# Altium schematic sheet Motordrivare.SchDoc
size A4
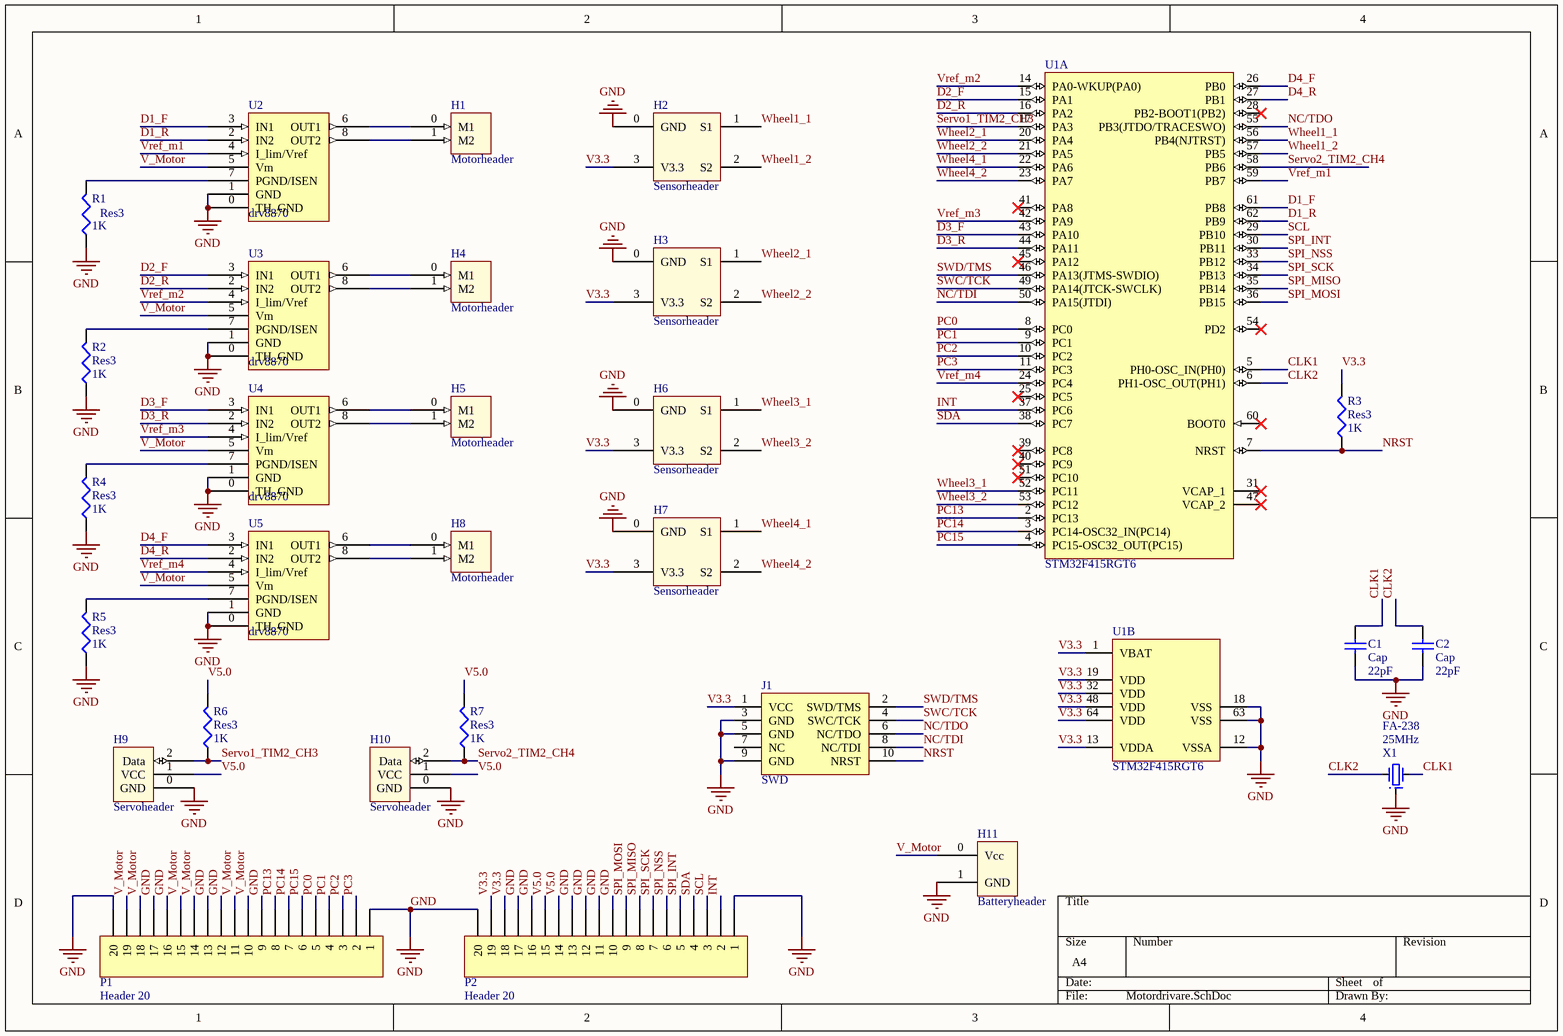
[diagram p0: Motordrivare.SchDoc]

## Parts
C1  Cap  value 22pF  [6-0805_M]
C2  Cap  value 22pF  [6-0805_M]
H1  Motorheader  [Motorheader]
H2  Sensorheader  [Sensorheader]
H3  Sensorheader  [Sensorheader]
H4  Motorheader  [Motorheader]
H5  Motorheader  [Motorheader]
H6  Sensorheader  [Sensorheader]
H7  Sensorheader  [Sensorheader]
H8  Motorheader  [Motorheader]
H9  Servoheader  [Servoheader]
H10  Servoheader  [Servoheader]
H11  Batteryheader  [Batteryheader]
J1  SWD  [hdr_2x5_50mil]
P1  Header 20  [HDR1X20]
P2  Header 20  [HDR1X20]
R1  Res3  value 1K  [J1-0603]
R2  Res3  value 1K  [J1-0603]
R3  Res3  value 1K  [J1-0603]
R4  Res3  value 1K  [J1-0603]
R5  Res3  value 1K  [J1-0603]
R6  Res3  value 1K  [J1-0603]
R7  Res3  value 1K  [J1-0603]
U1  STM32F415RGT6  [STM-LQFP64_N]  (parts A,B of 2)
U2  drv8870  [DRV8p]
U3  drv8870  [DRV8p]
U4  drv8870  [DRV8p]
U5  drv8870  [DRV8p]
X1  FA-238  freq: 25MHz  [DFN220P320X70-4N]

## Nets
GND: C1.1 C2.1 H2.0(GND) H3.0(GND) H6.0(GND) H7.0(GND) H9.0(GND) H10.0(GND) H11.1(GND) J1.3(GND) J1.5(GND) J1.9(GND) P1.1 P1.9 P1.12 P1.13 P1.16 P1.17 P1.20 P2.1 P2.10 P2.11 P2.12 P2.13 P2.16 P2.17 P2.20 R1.1 R2.1 R4.1 R5.1 U1.12(VSSA) U1.18(VSS) U1.63(VSS) U2.0(TH_GND) U2.1(GND) U3.0(TH_GND) U3.1(GND) U4.0(TH_GND) U4.1(GND) U5.0(TH_GND) U5.1(GND) X1.SHIELD
CLK1: C1.2 U1.5(PH0-OSC_IN(PH0)) X1.2
CLK2: C2.2 U1.6(PH1-OSC_OUT(PH1)) X1.1
D1_F: U1.61(PB8) U2.3(IN1)
D1_R: U1.62(PB9) U2.2(IN2)
D2_F: U1.15(PA1) U3.3(IN1)
D2_R: U1.16(PA2) U3.2(IN2)
D3_F: U1.43(PA10) U4.3(IN1)
D3_R: U1.44(PA11) U4.2(IN2)
D4_F: U1.26(PB0) U5.3(IN1)
D4_R: U1.27(PB1) U5.2(IN2)
INT: P2.2 U1.37(PC6)
NC/TDI: J1.8(NC/TDI) U1.50(PA15(JTDI))
NC/TDO: J1.6(NC/TDO) U1.55(PB3(JTDO/TRACESWO))
NRST: J1.10(NRST) R3.1 U1.7(NRST)
PC0: P1.5 U1.8(PC0)
PC1: P1.4 U1.9(PC1)
PC2: P1.3 U1.10(PC2)
PC3: P1.2 U1.11(PC3)
PC13: P1.8 U1.2(PC13)
PC14: P1.7 U1.3(PC14-OSC32_IN(PC14))
PC15: P1.6 U1.4(PC15-OSC32_OUT(PC15))
SCL: P2.3 U1.29(PB10)
SDA: P2.4 U1.38(PC7)
Servo1_TIM2_CH3: H9.2(Data) R6.1 U1.17(PA3)
Servo2_TIM2_CH4: H10.2(Data) R7.1 U1.58(PB6)
SPI_INT: P2.5 U1.30(PB11)
SPI_MISO: P2.8 U1.35(PB14)
SPI_MOSI: P2.9 U1.36(PB15)
SPI_NSS: P2.6 U1.33(PB12)
SPI_SCK: P2.7 U1.34(PB13)
SWC/TCK: J1.4(SWC/TCK) U1.49(PA14(JTCK-SWCLK))
SWD/TMS: J1.2(SWD/TMS) U1.46(PA13(JTMS-SWDIO))
V3.3: H2.3(V3.3) H3.3(V3.3) H6.3(V3.3) H7.3(V3.3) J1.1(VCC) P2.18 P2.19 R3.2 U1.1(VBAT) U1.13(VDDA) U1.19(VDD) U1.32(VDD) U1.48(VDD) U1.64(VDD)
V5.0: H9.1(VCC) H10.1(VCC) P2.14 P2.15 R6.2 R7.2
V_Motor: H11.0(Vcc) P1.10 P1.11 P1.14 P1.15 P1.18 P1.19 U2.5(Vm) U3.5(Vm) U4.5(Vm) U5.5(Vm)
Vref_m1: U1.59(PB7) U2.4(I_lim/Vref)
Vref_m2: U1.14(PA0-WKUP(PA0)) U3.4(I_lim/Vref)
Vref_m3: U1.42(PA9) U4.4(I_lim/Vref)
Vref_m4: U1.24(PC4) U5.4(I_lim/Vref)
Wheel1_1: H2.1(S1) U1.56(PB4(NJTRST))
Wheel1_2: H2.2(S2) U1.57(PB5)
Wheel2_1: H3.1(S1) U1.20(PA4)
Wheel2_2: H3.2(S2) U1.21(PA5)
Wheel3_1: H6.1(S1) U1.52(PC11)
Wheel3_2: H6.2(S2) U1.53(PC12)
Wheel4_1: H7.1(S1) U1.22(PA6)
Wheel4_2: H7.2(S2) U1.23(PA7)
NetH1_0: H1.0(M1) U2.6(OUT1)
NetH1_1: H1.1(M2) U2.8(OUT2)
NetH4_0: H4.0(M1) U3.6(OUT1)
NetH4_1: H4.1(M2) U3.8(OUT2)
NetH5_0: H5.0(M1) U4.6(OUT1)
NetH5_1: H5.1(M2) U4.8(OUT2)
NetH8_0: H8.0(M1) U5.6(OUT1)
NetH8_1: H8.1(M2) U5.8(OUT2)
NetR1_2: R1.2 U2.7(PGND/ISEN)
NetR2_2: R2.2 U3.7(PGND/ISEN)
NetR4_2: R4.2 U4.7(PGND/ISEN)
NetR5_2: R5.2 U5.7(PGND/ISEN)

Not connected (* = marked no-connect by the designer): J1 7(NC); U1 25(PC5)* 28(PB2-BOOT1(PB2))* 31(VCAP_1)* 39(PC8)* 40(PC9)* 41(PA8)* 45(PA12)* 47(VCAP_2)* 51(PC10)* 54(PD2)* 60(BOOT0)*

## Library data of the parts
C1 C2 = Cap: Capacitor; Published: 8-Jun-2000; LatestRevisionDate: 17-Jul-2002; LatestRevisionNote: Re-released for DXP Platform.; PackageReference: RAD-0.3; Publisher: Altium Limited; PackageDescription: Radial Cap, Thru-Hole; 2 Leads; 0.3 in Pin Spacing
J1 = hdr_swd: SWD Header
P1 P2 = Header 20: Header, 20-Pin; LatestRevisionDate: 17-Jul-2002; LatestRevisionNote: Re-released for DXP Platform.; Publisher: Altium Limited
R1-R7 = Res3: Resistor; Published: 8-Jun-2000; LatestRevisionDate: 29-May-2009; LatestRevisionNote: IPC-7351 Footprint Added.; PackageReference: J1-0603; Publisher: Altium Limited; PackageDescription: Chip Resistor
U1 = STM32F415RGT6: ARM Cortex-M4 32-bit MCU+FPU, 210 DMIPS, 1024 kB Flash, 192 kB Internal RAM, 51 I/Os, 64-pin LQFP, -40 to 85 degC, Tray; Manufacturer: STMicroelectronics; D/A Converter: 2x12-bit; FLASH Size (Prog) (kB): 1024; I/Os (High Current): 51; Internal RAM Size (kB): 192; Operating Frequency(F) (Processor speed) (MHz): 168; Supply Voltage(Vcc) max (V): 3.6; Supply Voltage(Vcc) min (V): 1.8; DatasheetVersion: Rev. 4; PackageVersion: Rev. 4, 06/2013; PackageReference: LQFP64; PackageDescription: 64-Pin Low Profile Quad Flat Package, 10 x 10 mm Body, 0.5 mm Pitch; Supplier 1: Digi-Key; Supplier Part Number 1: 497-11907-ND; Supplier 2: Farnell; Supplier Part Number 2: 2064370; Supplier 3: Newark; Supplier Part Number 3: 73T2335; Supplier 4: Mouser; Supplier Part Number 4: 511-STM32F415RGT6; Core: ARM Cortex-M4; Packing: Tray; Mounting Technology: Surface Mount; PartNumber: STM32F415RGT6; ComponentLink1Description: Manufacturer URL; ComponentLink1URL: http://www.st.com/web/en/home.html; ComponentLink2Description: Datasheet; ComponentLink2URL: http://www.st.com/st-web-ui/static/active/en/resource/technical/document/datasheet/DM00035129.pdf; ComponentLink3Description: Package Specification; ComponentLink3URL: http://www.st.com/st-web-ui/static/active/en/resource/technical/document/datasheet/DM00037051.pdf
X1 = crystal: Crystal With Shield